# EAGLE schematic watering_controller (EAGLE 8.3.0)
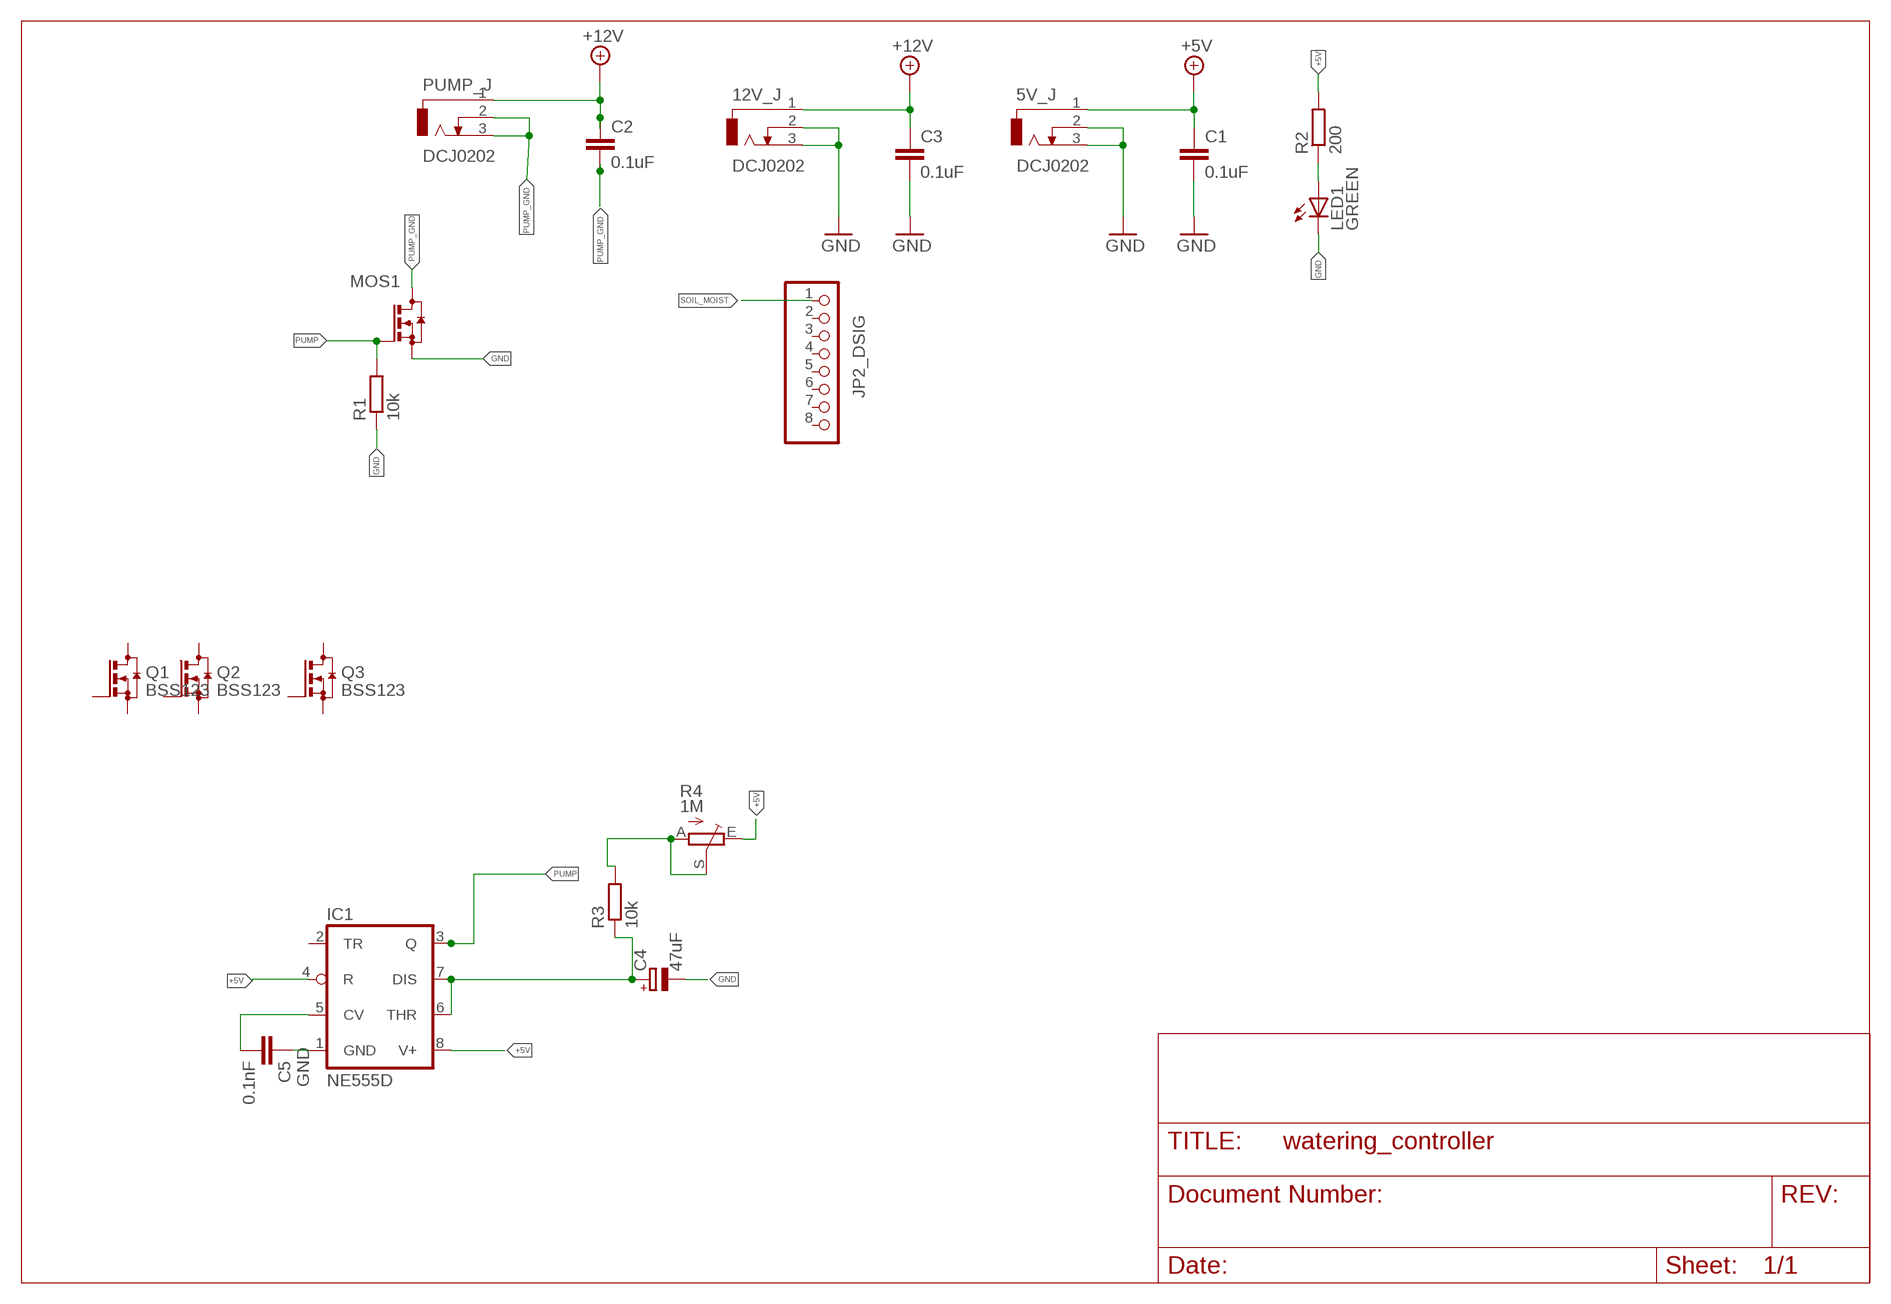
[diagram p0: schematic, sheet 1]

## Parts
5V_J  DCJ0202  [DCJ0202]
12V_J  DCJ0202  [DCJ0202]
C1  0.1uF  C-EUC0805  [C0805]
C2  0.1uF  C-EUC0805  [C0805]
C3  0.1uF  C-EUC0805  [C0805]
C4  47uF  CPOL-EUA/3216-18R  [A/3216-18R]
C5  0.1nF  C-EUC0805  [C0805]
IC1  NE555D  [SO08]
JP1  JP2_DSIG  PINHD-1X8  [1X08]
LED1  GREEN  LEDSML0805  [SML0805]
MOS1  FDN359BN  [SOT23]
PUMP_J  DCJ0202  [DCJ0202]
Q1  BSS123  [SOT23]
Q2  BSS123  [SOT23]
Q3  BSS123  [SOT23]
R1  10k  R-EU_M0805  [M0805]
R2  200  R-EU_M0805  [M0805]
R3  10k  R-EU_M0805  [M0805]
R4  1M  TRIM_EU-B25P  [B25P]

## Nets
+5V: IC1.4(R) IC1.8(V+) R2.2 R4.E
+9V: 5V_J.1 12V_J.1 C1.1 C2.1 C3.1 PUMP_J.1 ; supply symbol labelled +12V, +5V
GND: 5V_J.2 5V_J.3 12V_J.2 12V_J.3 C1.2 C3.2 C4.- C5.1 IC1.1(GND) LED1.C MOS1.2(S) R1.1
N$1: C5.2 IC1.5(CV)
N$2: R3.2 R4.A R4.S
N$3: C4.+ IC1.6(THR) IC1.7(DIS) R3.1
N$4: LED1.A R2.1
PUMP: IC1.3(Q) MOS1.1(G) R1.2
PUMP_GND: C2.2 MOS1.3(D) PUMP_J.2 PUMP_J.3
SOIL_MOIST: JP1.1
Unconnected: IC1.2(TR) JP1.2 JP1.3 JP1.4 JP1.5 JP1.6 JP1.7 JP1.8 Q1.1(G) Q1.2(S) Q1.3(D) Q2.1(G) Q2.2(S) Q2.3(D) Q3.1(G) Q3.2(S) Q3.3(D)

## Library data of the parts
5V_J 12V_J PUMP_J = con-jack:DCJ0202: DC POWER JACK Source: DCJ0202.pdf; OC_FARNELL: unknown; OC_NEWARK: unknown
C1-C3 C5 = rcl:C-EU: CAPACITOR, European symbol
C4 = rcl:CPOL-EU: POLARIZED CAPACITOR, European symbol
IC1 = linear:*555: TIMER
JP1 = pinhead:PINHD-1X8: PIN HEADER
LED1 = led:LED: LED OSRAM: - CHIPLED LG R971, LG N971, LY N971, LG Q971, LY Q971, LO R971, LY R971 LH N974, LH R974 LS Q976, LO Q976, LY Q976 LO Q996 - Hyper CHIPLED LW Q18S LB Q993, LB Q99A, LB R99A - SideLED LS A670, LO A670, LY A670, LG A670, LP A670 LB A673, LV A673, LT A673, LW A673 LH A674 LY A675 LS A676, LA A676, LO A676, LY A676, LW A676 LS A679, LY A679, LG A679 - Hyper Micro SIDELED® LS Y876, LA Y876, LO Y876, LY Y876 LT Y87S - SmartLED LW L88C, LW L88S LB L89C, LB L89S, LG L890 LS L89K, LO L89K, LY L89K LS L896, LA L896, LO L896, LY L896 - TOPLED LS T670, LO T670, LY T670, LG T670, LP T670 LSG T670, LSP T670, LSY T670, LOP T670, LYG T670 LG T671, LOG T671, LSG T671 LB T673, LV T673, LT T673, LW T673 LH T674 LS T676, LA T676, LO T676, LY T676, LB T676, LH T676, LSB T676, LW T676 LB T67C, LV T67C, LT T67C, LS T67K, LO T67K, LY T67K, LW E67C LS E67B, LA E67B, LO E67B, LY E67B, LB E67C, LV E67C, LT E67C LW T67C LS T679, LY T679, LG T679 LS T770, LO T770, LY T770, LG T770, LP T770 LB T773, LV T773, LT T773, LW T773 LH T774 LS E675, LA E675, LY E675, LS T675 LS T776, LA T776, LO T776, LY T776, LB T776 LHGB T686 LT T68C, LB T68C - Hyper Mini TOPLED® LB M676 - Mini TOPLED Santana® LG M470 LS M47K, LO M47K, LY M47K Source: http://www.osram.convergy.de LUXEON: - LUMILED® LXK2-PW12-R00, LXK2-PW12-S00, LXK2-PW14-U00, LXK2-PW14-V00 LXK2-PM12-R00, LXK2-PM12-S00, LXK2-PM14-U00 LXK2-PE12-Q00, LXK2-PE12-R00, LXK2-PE12-S00, LXK2-PE14-T00, LXK2-PE14-U00 LXK2-PB12-K00, LXK2-PB12-L00, LXK2-PB12-M00, LXK2-PB14-N00, LXK2-PB14-P00, LXK2-PB14-Q00 LXK2-PR12-L00, LXK2-PR12-M00, LXK2-PR14-Q00, LXK2-PR14-R00 LXK2-PD12-Q00, LXK2-PD12-R00, LXK2-PD12-S00 LXK2-PH12-R00, LXK2-PH12-S00 LXK2-PL12-P00, LXK2-PL12-Q00, LXK2-PL12-R00 Source: www.luxeon.com KINGBRIGHT: KA-3528ASYC Source: www.kingbright.com
MOS1 = ckr_parts:FDN359BN: FDN359BN N-Channel Logic Level MOS-FET
Q1-Q3 = transistor-small-signal:BSS123: N-CHANNEL MOS FET
R1-R3 = resistor:R-EU_: RESISTOR, European symbol
R4 = pot:TRIM_EU-: POTENTIOMETER